# EAGLE design base (EAGLE 9.3.1)
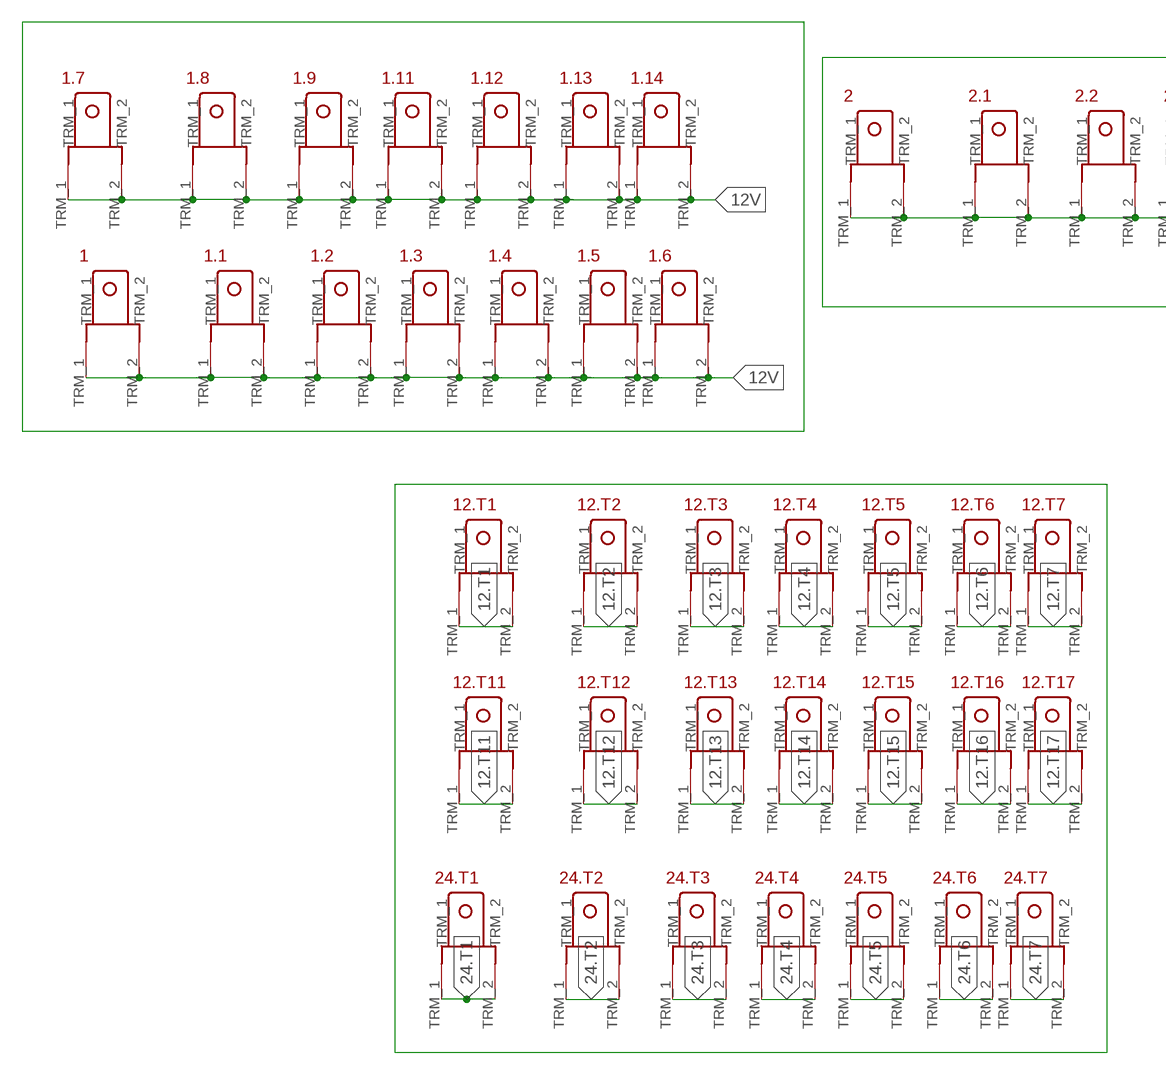
[diagram p0: schematic, sheet 1, part 1 of 2]
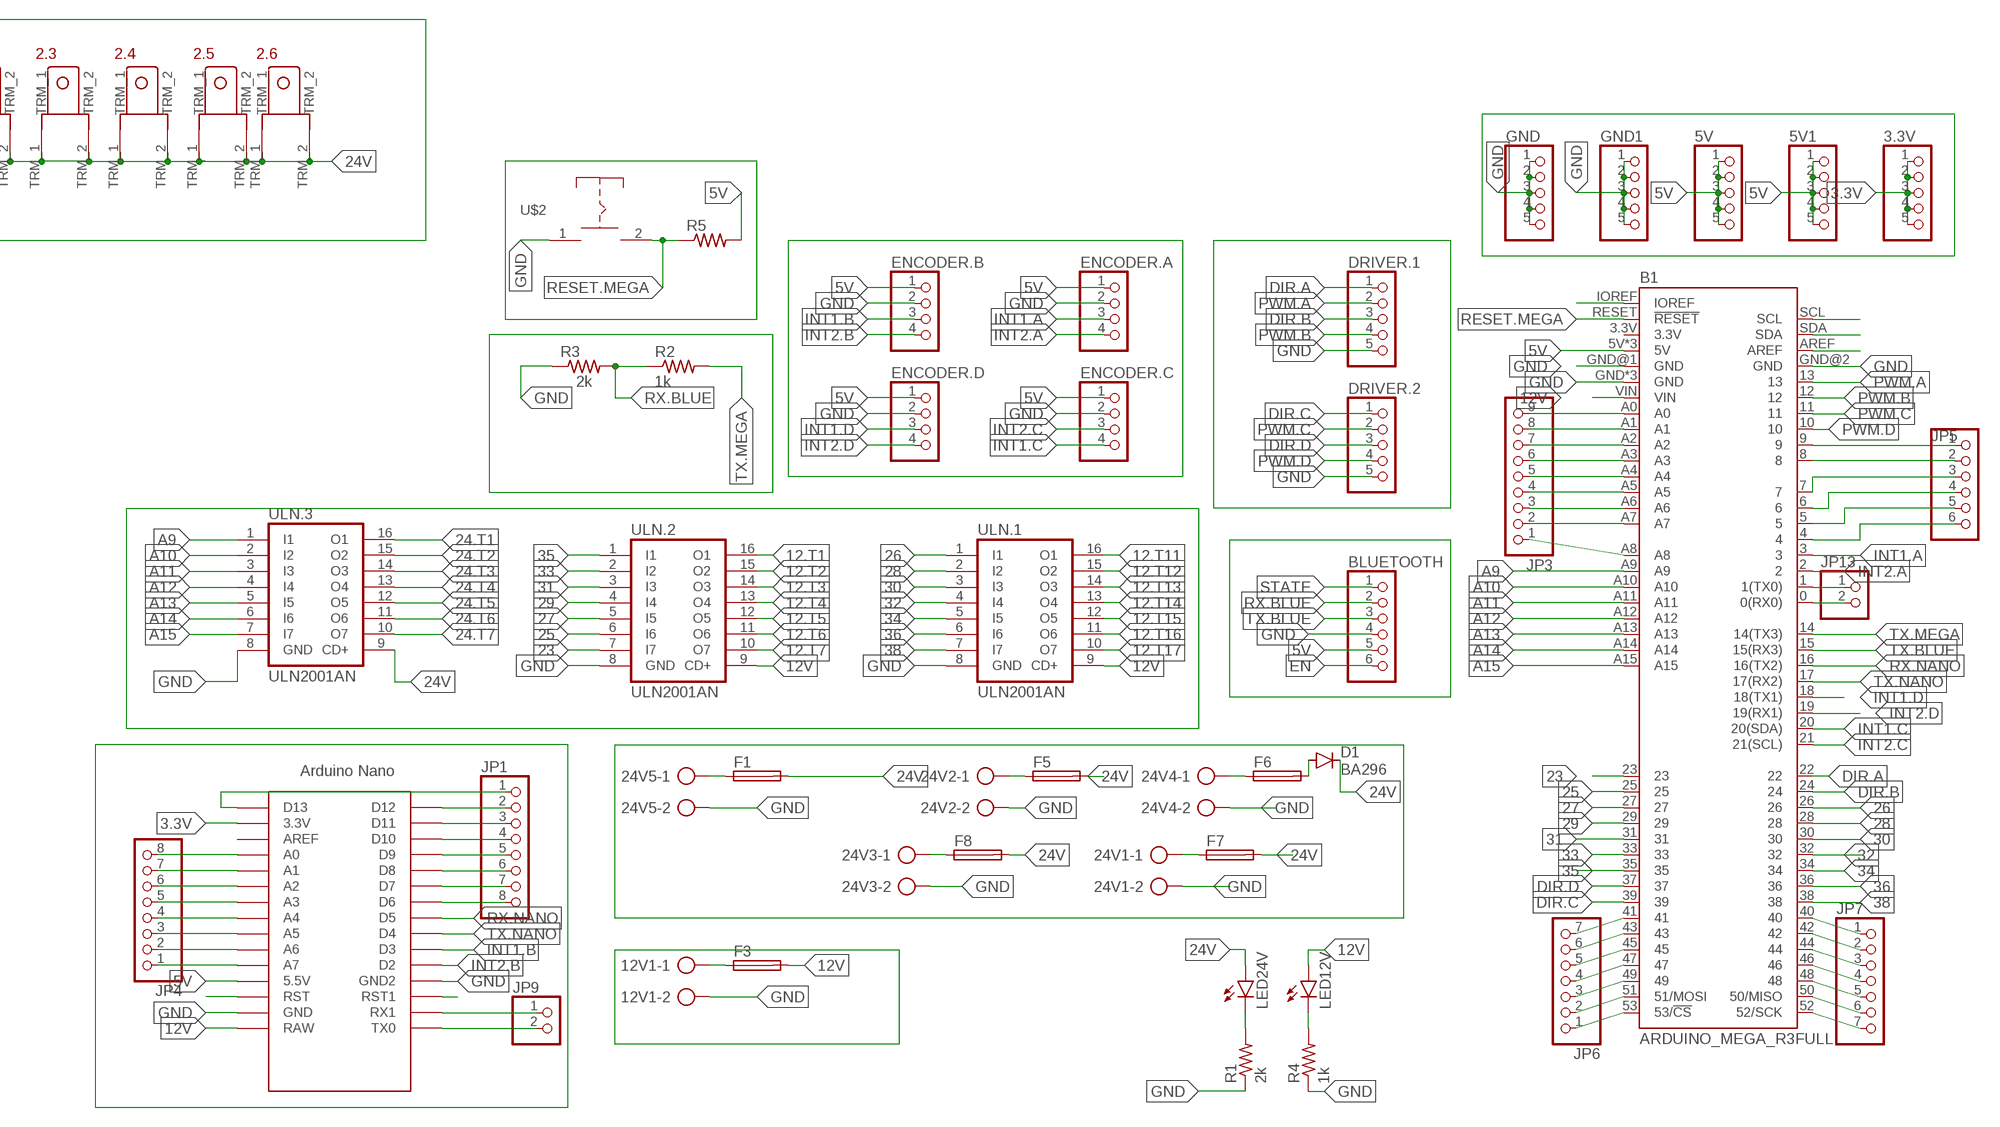
[diagram p1: schematic, sheet 1, part 2 of 2]

## Parts
1  TERMINAL_EDITED  [TERMINAL_EDITED]
1.1  TERMINAL_EDITED  [TERMINAL_EDITED]
1.2  TERMINAL_EDITED  [TERMINAL_EDITED]
1.3  TERMINAL_EDITED  [TERMINAL_EDITED]
1.4  TERMINAL_EDITED  [TERMINAL_EDITED]
1.5  TERMINAL_EDITED  [TERMINAL_EDITED]
1.6  TERMINAL_EDITED  [TERMINAL_EDITED]
1.7  TERMINAL_EDITED  [TERMINAL_EDITED]
1.8  TERMINAL_EDITED  [TERMINAL_EDITED]
1.9  TERMINAL_EDITED  [TERMINAL_EDITED]
1.11  TERMINAL_EDITED  [TERMINAL_EDITED]
1.12  TERMINAL_EDITED  [TERMINAL_EDITED]
1.13  TERMINAL_EDITED  [TERMINAL_EDITED]
1.14  TERMINAL_EDITED  [TERMINAL_EDITED]
2  TERMINAL_EDITED  [TERMINAL_EDITED]
2.1  TERMINAL_EDITED  [TERMINAL_EDITED]
2.2  TERMINAL_EDITED  [TERMINAL_EDITED]
2.3  TERMINAL_EDITED  [TERMINAL_EDITED]
2.4  TERMINAL_EDITED  [TERMINAL_EDITED]
2.5  TERMINAL_EDITED  [TERMINAL_EDITED]
2.6  TERMINAL_EDITED  [TERMINAL_EDITED]
3.3V  PINHD-1X5  [1X05]
5V  PINHD-1X5  [1X05]
5V1  PINHD-1X5  [1X05]
12.T1  TERMINAL_EDITED  [TERMINAL_EDITED]
12.T2  TERMINAL_EDITED  [TERMINAL_EDITED]
12.T3  TERMINAL_EDITED  [TERMINAL_EDITED]
12.T4  TERMINAL_EDITED  [TERMINAL_EDITED]
12.T5  TERMINAL_EDITED  [TERMINAL_EDITED]
12.T6  TERMINAL_EDITED  [TERMINAL_EDITED]
12.T7  TERMINAL_EDITED  [TERMINAL_EDITED]
12.T11  TERMINAL_EDITED  [TERMINAL_EDITED]
12.T12  TERMINAL_EDITED  [TERMINAL_EDITED]
12.T13  TERMINAL_EDITED  [TERMINAL_EDITED]
12.T14  TERMINAL_EDITED  [TERMINAL_EDITED]
12.T15  TERMINAL_EDITED  [TERMINAL_EDITED]
12.T16  TERMINAL_EDITED  [TERMINAL_EDITED]
12.T17  TERMINAL_EDITED  [TERMINAL_EDITED]
12V1  AK300/2  [AK300/2]
24.T1  TERMINAL_EDITED  [TERMINAL_EDITED]
24.T2  TERMINAL_EDITED  [TERMINAL_EDITED]
24.T3  TERMINAL_EDITED  [TERMINAL_EDITED]
24.T4  TERMINAL_EDITED  [TERMINAL_EDITED]
24.T5  TERMINAL_EDITED  [TERMINAL_EDITED]
24.T6  TERMINAL_EDITED  [TERMINAL_EDITED]
24.T7  TERMINAL_EDITED  [TERMINAL_EDITED]
24V1  AK300/2  [AK300/2]
24V2  AK300/2  [AK300/2]
24V3  AK300/2  [AK300/2]
24V4  AK300/2  [AK300/2]
24V5  AK300/2  [AK300/2]
B1  ARDUINO_MEGA_R3FULL  [ARDUINO_MEGA_NO_SILK]
BLUETOOTH  PINHD-1X6  [1X06]
D1  BA296  [P2-15]
DRIVER.1  PINHD-1X5  [1X05]
DRIVER.2  PINHD-1X5  [1X05]
ENCODER.A  PINHD-1X4  [1X04]
ENCODER.B  PINHD-1X4  [1X04]
ENCODER.C  PINHD-1X4  [1X04]
ENCODER.D  PINHD-1X4  [1X04]
F1  SH22,5A  [SH22,5A]
F3  SH22,5A  [SH22,5A]
F5  SH22,5A  [SH22,5A]
F6  SH22,5A  [SH22,5A]
F7  SH22,5A  [SH22,5A]
F8  SH22,5A  [SH22,5A]
GND  PINHD-1X5  [1X05]
GND1  PINHD-1X5  [1X05]
JP1  PINHD-1X8  [1X08]
JP3  PINHD-1X9  [1X09]
JP4  PINHD-1X8  [1X08]
JP5  PINHD-1X6  [1X06]
JP6  PINHD-1X7  [1X07]
JP7  PINHD-1X7  [1X07]
JP9  PINHD-1X2  [1X02]
JP13  PINHD-1X2  [1X02]
LED12V  LED5MM  [LED5MM]
LED24V  LED5MM  [LED5MM]
R1  2k  R-US_0207/10  [0207/10]
R2  1k  R-US_0204/7  [0204/7]
R3  2k  R-US_0207/10  [0207/10]
R4  1k  R-US_0207/10  [0207/10]
R5  R-US_0207/12  [0207/12]
U$1  NANO  [NANO]
U$2  PUSHBOTTON  [PUSHBOTTON]
ULN.1  ULN2001AN  [DIL16]
ULN.2  ULN2001AN  [DIL16]
ULN.3  ULN2001AN  [DIL16]

## Nets
3.3V: 3.3V.1 3.3V.2 3.3V.3 3.3V.4 3.3V.5 U$1.3.3V
5V: 5V1.1 5V1.2 5V1.3 5V1.4 5V1.5 5V.1 5V.2 5V.3 5V.4 5V.5 B1.5V B1.5V@1(5V) B1.5V@2(5V) BLUETOOTH.5 ENCODER.A.1 ENCODER.B.1 ENCODER.C.1 ENCODER.D.1 R5.2 U$1.5V(5.5V)
12.T1: 12.T1.TRM_1 12.T1.TRM_2 ULN.2.16(O1)
12.T2: 12.T2.TRM_1 12.T2.TRM_2 ULN.2.15(O2)
12.T3: 12.T3.TRM_1 12.T3.TRM_2 ULN.2.14(O3)
12.T4: 12.T4.TRM_1 12.T4.TRM_2 ULN.2.13(O4)
12.T5: 12.T5.TRM_1 12.T5.TRM_2 ULN.2.12(O5)
12.T6: 12.T6.TRM_1 12.T6.TRM_2 ULN.2.11(O6)
12.T7: 12.T7.TRM_1 12.T7.TRM_2 ULN.2.10(O7)
12.T11: 12.T11.TRM_1 12.T11.TRM_2 ULN.1.16(O1)
12.T12: 12.T12.TRM_1 12.T12.TRM_2 ULN.1.15(O2)
12.T13: 12.T13.TRM_1 12.T13.TRM_2 ULN.1.14(O3)
12.T14: 12.T14.TRM_1 12.T14.TRM_2 ULN.1.13(O4)
12.T15: 12.T15.TRM_1 12.T15.TRM_2 ULN.1.12(O5)
12.T16: 12.T16.TRM_1 12.T16.TRM_2 ULN.1.11(O6)
12.T17: 12.T17.TRM_1 12.T17.TRM_2 ULN.1.10(O7)
12V: 1.1.TRM_1 1.1.TRM_2 1.2.TRM_1 1.2.TRM_2 1.3.TRM_1 1.3.TRM_2 1.4.TRM_1 1.4.TRM_2 1.5.TRM_1 1.5.TRM_2 1.6.TRM_1 1.6.TRM_2 1.7.TRM_1 1.7.TRM_2 1.8.TRM_1 1.8.TRM_2 1.9.TRM_1 1.9.TRM_2 1.11.TRM_1 1.11.TRM_2 1.12.TRM_1 1.12.TRM_2 1.13.TRM_1 1.13.TRM_2 1.14.TRM_1 1.14.TRM_2 1.TRM_1 1.TRM_2 B1.VIN F3.2 LED12V.A U$1.RAW ULN.1.9(CD+) ULN.2.9(CD+)
23: B1.23 ULN.2.7(I7)
24.T1: 24.T1.TRM_1 24.T1.TRM_2 ULN.3.16(O1)
24.T2: 24.T2.TRM_1 24.T2.TRM_2 ULN.3.15(O2)
24.T3: 24.T3.TRM_1 24.T3.TRM_2 ULN.3.14(O3)
24.T4: 24.T4.TRM_1 24.T4.TRM_2 ULN.3.13(O4)
24.T5: 24.T5.TRM_1 24.T5.TRM_2 ULN.3.12(O5)
24.T6: 24.T6.TRM_1 24.T6.TRM_2 ULN.3.11(O6)
24.T7: 24.T7.TRM_1 24.T7.TRM_2 ULN.3.10(O7)
24V: 2.1.TRM_1 2.1.TRM_2 2.2.TRM_1 2.2.TRM_2 2.3.TRM_1 2.3.TRM_2 2.4.TRM_1 2.4.TRM_2 2.5.TRM_1 2.5.TRM_2 2.6.TRM_1 2.6.TRM_2 2.TRM_1 2.TRM_2 D1.C F1.2 F5.2 F7.2 F8.2 LED24V.A ULN.3.9(CD+)
25: B1.25 ULN.2.6(I6)
26: B1.26 ULN.1.1(I1)
27: B1.27 ULN.2.5(I5)
28: B1.28 ULN.1.2(I2)
29: B1.29 ULN.2.4(I4)
30: B1.30 ULN.1.3(I3)
31: B1.31 ULN.2.3(I3)
32: B1.32 ULN.1.4(I4)
33: B1.33 ULN.2.2(I2)
34: B1.34 ULN.1.5(I5)
35: B1.35 ULN.2.1(I1)
36: B1.36 ULN.1.6(I6)
38: B1.38 ULN.1.7(I7)
40: B1.40 JP7.1
A9: B1.A9 ULN.3.1(I1)
A10: B1.A10 ULN.3.2(I2)
A11: B1.A11 ULN.3.3(I3)
A12: B1.A12 ULN.3.4(I4)
A13: B1.A13 ULN.3.5(I5)
A14: B1.A14 ULN.3.6(I6)
A15: B1.A15 ULN.3.7(I7)
DIR.A: B1.22 DRIVER.1.1
DIR.B: B1.24 DRIVER.1.3
DIR.C: B1.39 DRIVER.2.1
DIR.D: B1.37 DRIVER.2.3
EN: BLUETOOTH.6
GND: 12V1.2 24V1.2 24V2.2 24V3.2 24V4.2 24V5.2 B1.GND B1.GND@1(GND) B1.GND@2(GND) B1.GND@3(GND) B1.GND@4(GND) BLUETOOTH.4 DRIVER.1.5 DRIVER.2.5 ENCODER.A.2 ENCODER.B.2 ENCODER.C.2 ENCODER.D.2 GND1.1 GND1.2 GND1.3 GND1.4 GND1.5 GND.1 GND.2 GND.3 GND.4 GND.5 R1.1 R3.1 R4.1 U$1.GND U$1.GND1(GND2) U$2.1 ULN.1.8(GND) ULN.2.8(GND) ULN.3.8(GND)
INT1.A: B1.3 ENCODER.A.3
INT1.B: ENCODER.B.3 U$1.D3
INT1.C: B1.20(20(SDA)) ENCODER.C.4
INT1.D: B1.18(18(TX1)) ENCODER.D.3
INT2.A: B1.2 ENCODER.A.4
INT2.B: ENCODER.B.4 U$1.D2
INT2.C: B1.21(21(SCL)) ENCODER.C.3
INT2.D: B1.19(19(RX1)) ENCODER.D.4
N$1: B1.SCL
N$2: B1.SDA
N$3: B1.AREF
N$9: B1.9 JP5.1
N$10: B1.8 JP5.2
N$11: B1.7 JP5.3
N$12: B1.6 JP5.4
N$13: B1.5 JP5.5
N$14: B1.4 JP5.6
N$15: 24V1.1 F7.1
N$16: 24V4.1 F6.1
N$17: B1.1(1(TX0)) JP13.1
N$18: B1.0(0(RX0)) JP13.2
N$21: 24V2.1 F5.1
N$22: 24V3.1 F8.1
N$23: LED24V.K(C) R1.2
N$24: LED12V.K(C) R4.2
N$25: D1.A F6.2
N$37: B1.42 JP7.2
N$38: B1.44 JP7.3
N$39: B1.46 JP7.4
N$40: B1.48 JP7.5
N$41: B1.50(50/MISO) JP7.6
N$42: B1.52(52/SCK) JP7.7
N$43: B1.IOREF
N$50: B1.A0 JP3.9
N$51: B1.A1 JP3.8
N$52: B1.A2 JP3.7
N$53: B1.A3 JP3.6
N$54: B1.A4 JP3.5
N$55: B1.A5 JP3.4
N$56: B1.A6 JP3.3
N$57: B1.A7 JP3.2
N$58: B1.A8 JP3.1
N$75: B1.41 JP6.7
N$76: B1.45 JP6.5
N$77: B1.43 JP6.6
N$78: B1.47 JP6.4
N$79: B1.49 JP6.3
N$80: B1.51(51/MOSI) JP6.2
N$81: B1.53(53/!CS) JP6.1
N$107: JP1.1 U$1.D13
N$110: JP4.8 U$1.A0
N$111: JP4.7 U$1.A1
N$112: JP4.6 U$1.A2
N$113: JP4.5 U$1.A3
N$114: JP4.4 U$1.A4
N$115: JP4.3 U$1.A5
N$116: JP4.2 U$1.A6
N$117: JP4.1 U$1.A7
N$119: U$1.RST
N$122: JP1.2 U$1.D12
N$123: JP1.3 U$1.D11
N$124: JP1.4 U$1.D10
N$125: JP1.5 U$1.D9
N$126: JP1.6 U$1.D8
N$127: JP1.7 U$1.D7
N$128: JP1.8 U$1.D6
N$134: U$1.RST1
N$135: JP9.1 U$1.RX1
N$136: JP9.2 U$1.TX0
N$138: 24V5.1 F1.1
N$152: 12V1.1 F3.1
PWM.A: B1.13 DRIVER.1.2
PWM.B: B1.12 DRIVER.1.4
PWM.C: B1.11 DRIVER.2.2
PWM.D: B1.10 DRIVER.2.4
RESET.MEGA: B1.RESET(!RESET) R5.1 U$2.2
RX.BLUE: BLUETOOTH.2 R2.1 R3.2
RX.NANO: B1.16(16(TX2)) U$1.D5
STATE: BLUETOOTH.1
TX.BLUE: B1.15(15(RX3)) BLUETOOTH.3
TX.MEGA: B1.14(14(TX3)) R2.2
TX.NANO: B1.17(17(RX2)) U$1.D4
Unconnected: B1.3.3V U$1.AREF

## Library data of the parts
1 1.1-1.9 1.11-1.14 2 2.1-2.6 12.T1-12.T7 12.T11-12.T17 24.T1-24.T7 = 1-ROV Components:TERMINAL_EDITED
3.3V 5V 5V1 DRIVER.1 DRIVER.2 GND GND1 = pinhead:PINHD-1X5: PIN HEADER
12V1 24V1-24V5 = con-ptr500:AK300/2: CONNECTOR; OC_FARNELL: unknown; OC_NEWARK: unknown
B1 = SparkFun-Boards:ARDUINO_MEGA_R3: Arduino Mega R3 ATmega2560 R3 compatible footprint. SparkFun Products: Arduino Mega 2560 R3 <https://www.sparkfun.com/products/11061>
BLUETOOTH JP5 = pinhead:PINHD-1X6: PIN HEADER
D1 = diode:BA296: DIODE
ENCODER.A ENCODER.B ENCODER.C ENCODER.D = pinhead:PINHD-1X4: PIN HEADER
F1 F3 F5-F8 = fuse:SH22,5A: FUSE HOLDER grid 22,5mm, isolated cap OGN0031 8201, Schurter (Buerklin); MPN: 0031.7701.11; OC_FARNELL: unknown; OC_NEWARK: 04F1224
JP1 JP4 = pinhead:PINHD-1X8: PIN HEADER
JP3 = pinhead:PINHD-1X9: PIN HEADER
JP6 JP7 = pinhead:PINHD-1X7: PIN HEADER
JP9 JP13 = pinhead:PINHD-1X2: PIN HEADER
LED12V LED24V = led:LED: LED OSRAM: - CHIPLED LG R971, LG N971, LY N971, LG Q971, LY Q971, LO R971, LY R971 LH N974, LH R974 LS Q976, LO Q976, LY Q976 LO Q996 - Hyper CHIPLED LW Q18S LB Q993, LB Q99A, LB R99A - SideLED LS A670, LO A670, LY A670, LG A670, LP A670 LB A673, LV A673, LT A673, LW A673 LH A674 LY A675 LS A676, LA A676, LO A676, LY A676, LW A676 LS A679, LY A679, LG A679 - Hyper Micro SIDELED® LS Y876, LA Y876, LO Y876, LY Y876 LT Y87S - SmartLED LW L88C, LW L88S LB L89C, LB L89S, LG L890 LS L89K, LO L89K, LY L89K LS L896, LA L896, LO L896, LY L896 - TOPLED LS T670, LO T670, LY T670, LG T670, LP T670 LSG T670, LSP T670, LSY T670, LOP T670, LYG T670 LG T671, LOG T671, LSG T671 LB T673, LV T673, LT T673, LW T673 LH T674 LS T676, LA T676, LO T676, LY T676, LB T676, LH T676, LSB T676, LW T676 LB T67C, LV T67C, LT T67C, LS T67K, LO T67K, LY T67K, LW E67C LS E67B, LA E67B, LO E67B, LY E67B, LB E67C, LV E67C, LT E67C LW T67C LS T679, LY T679, LG T679 LS T770, LO T770, LY T770, LG T770, LP T770 LB T773, LV T773, LT T773, LW T773 LH T774 LS E675, LA E675, LY E675, LS T675 LS T776, LA T776, LO T776, LY T776, LB T776 LHGB T686 LT T68C, LB T68C - Hyper Mini TOPLED® LB M676 - Mini TOPLED Santana® LG M470 LS M47K, LO M47K, LY M47K Source: http://www.osram.convergy.de LUXEON: - LUMILED® LXK2-PW12-R00, LXK2-PW12-S00, LXK2-PW14-U00, LXK2-PW14-V00 LXK2-PM12-R00, LXK2-PM12-S00, LXK2-PM14-U00 LXK2-PE12-Q00, LXK2-PE12-R00, LXK2-PE12-S00, LXK2-PE14-T00, LXK2-PE14-U00 LXK2-PB12-K00, LXK2-PB12-L00, LXK2-PB12-M00, LXK2-PB14-N00, LXK2-PB14-P00, LXK2-PB14-Q00 LXK2-PR12-L00, LXK2-PR12-M00, LXK2-PR14-Q00, LXK2-PR14-R00 LXK2-PD12-Q00, LXK2-PD12-R00, LXK2-PD12-S00 LXK2-PH12-R00, LXK2-PH12-S00 LXK2-PL12-P00, LXK2-PL12-Q00, LXK2-PL12-R00 Source: www.luxeon.com KINGBRIGHT: KA-3528ASYC Source: www.kingbright.com
R1-R5 = rcl:R-US_: RESISTOR, American symbol; SPICEPREFIX: R
U$1 = Arduino-clone:NANO: Arduino Nano
U$2 = push botton:PUSHBOTTON
ULN.1-ULN.3 = uln-udn:ULN2001A: DRIVER ARRAY

## Board
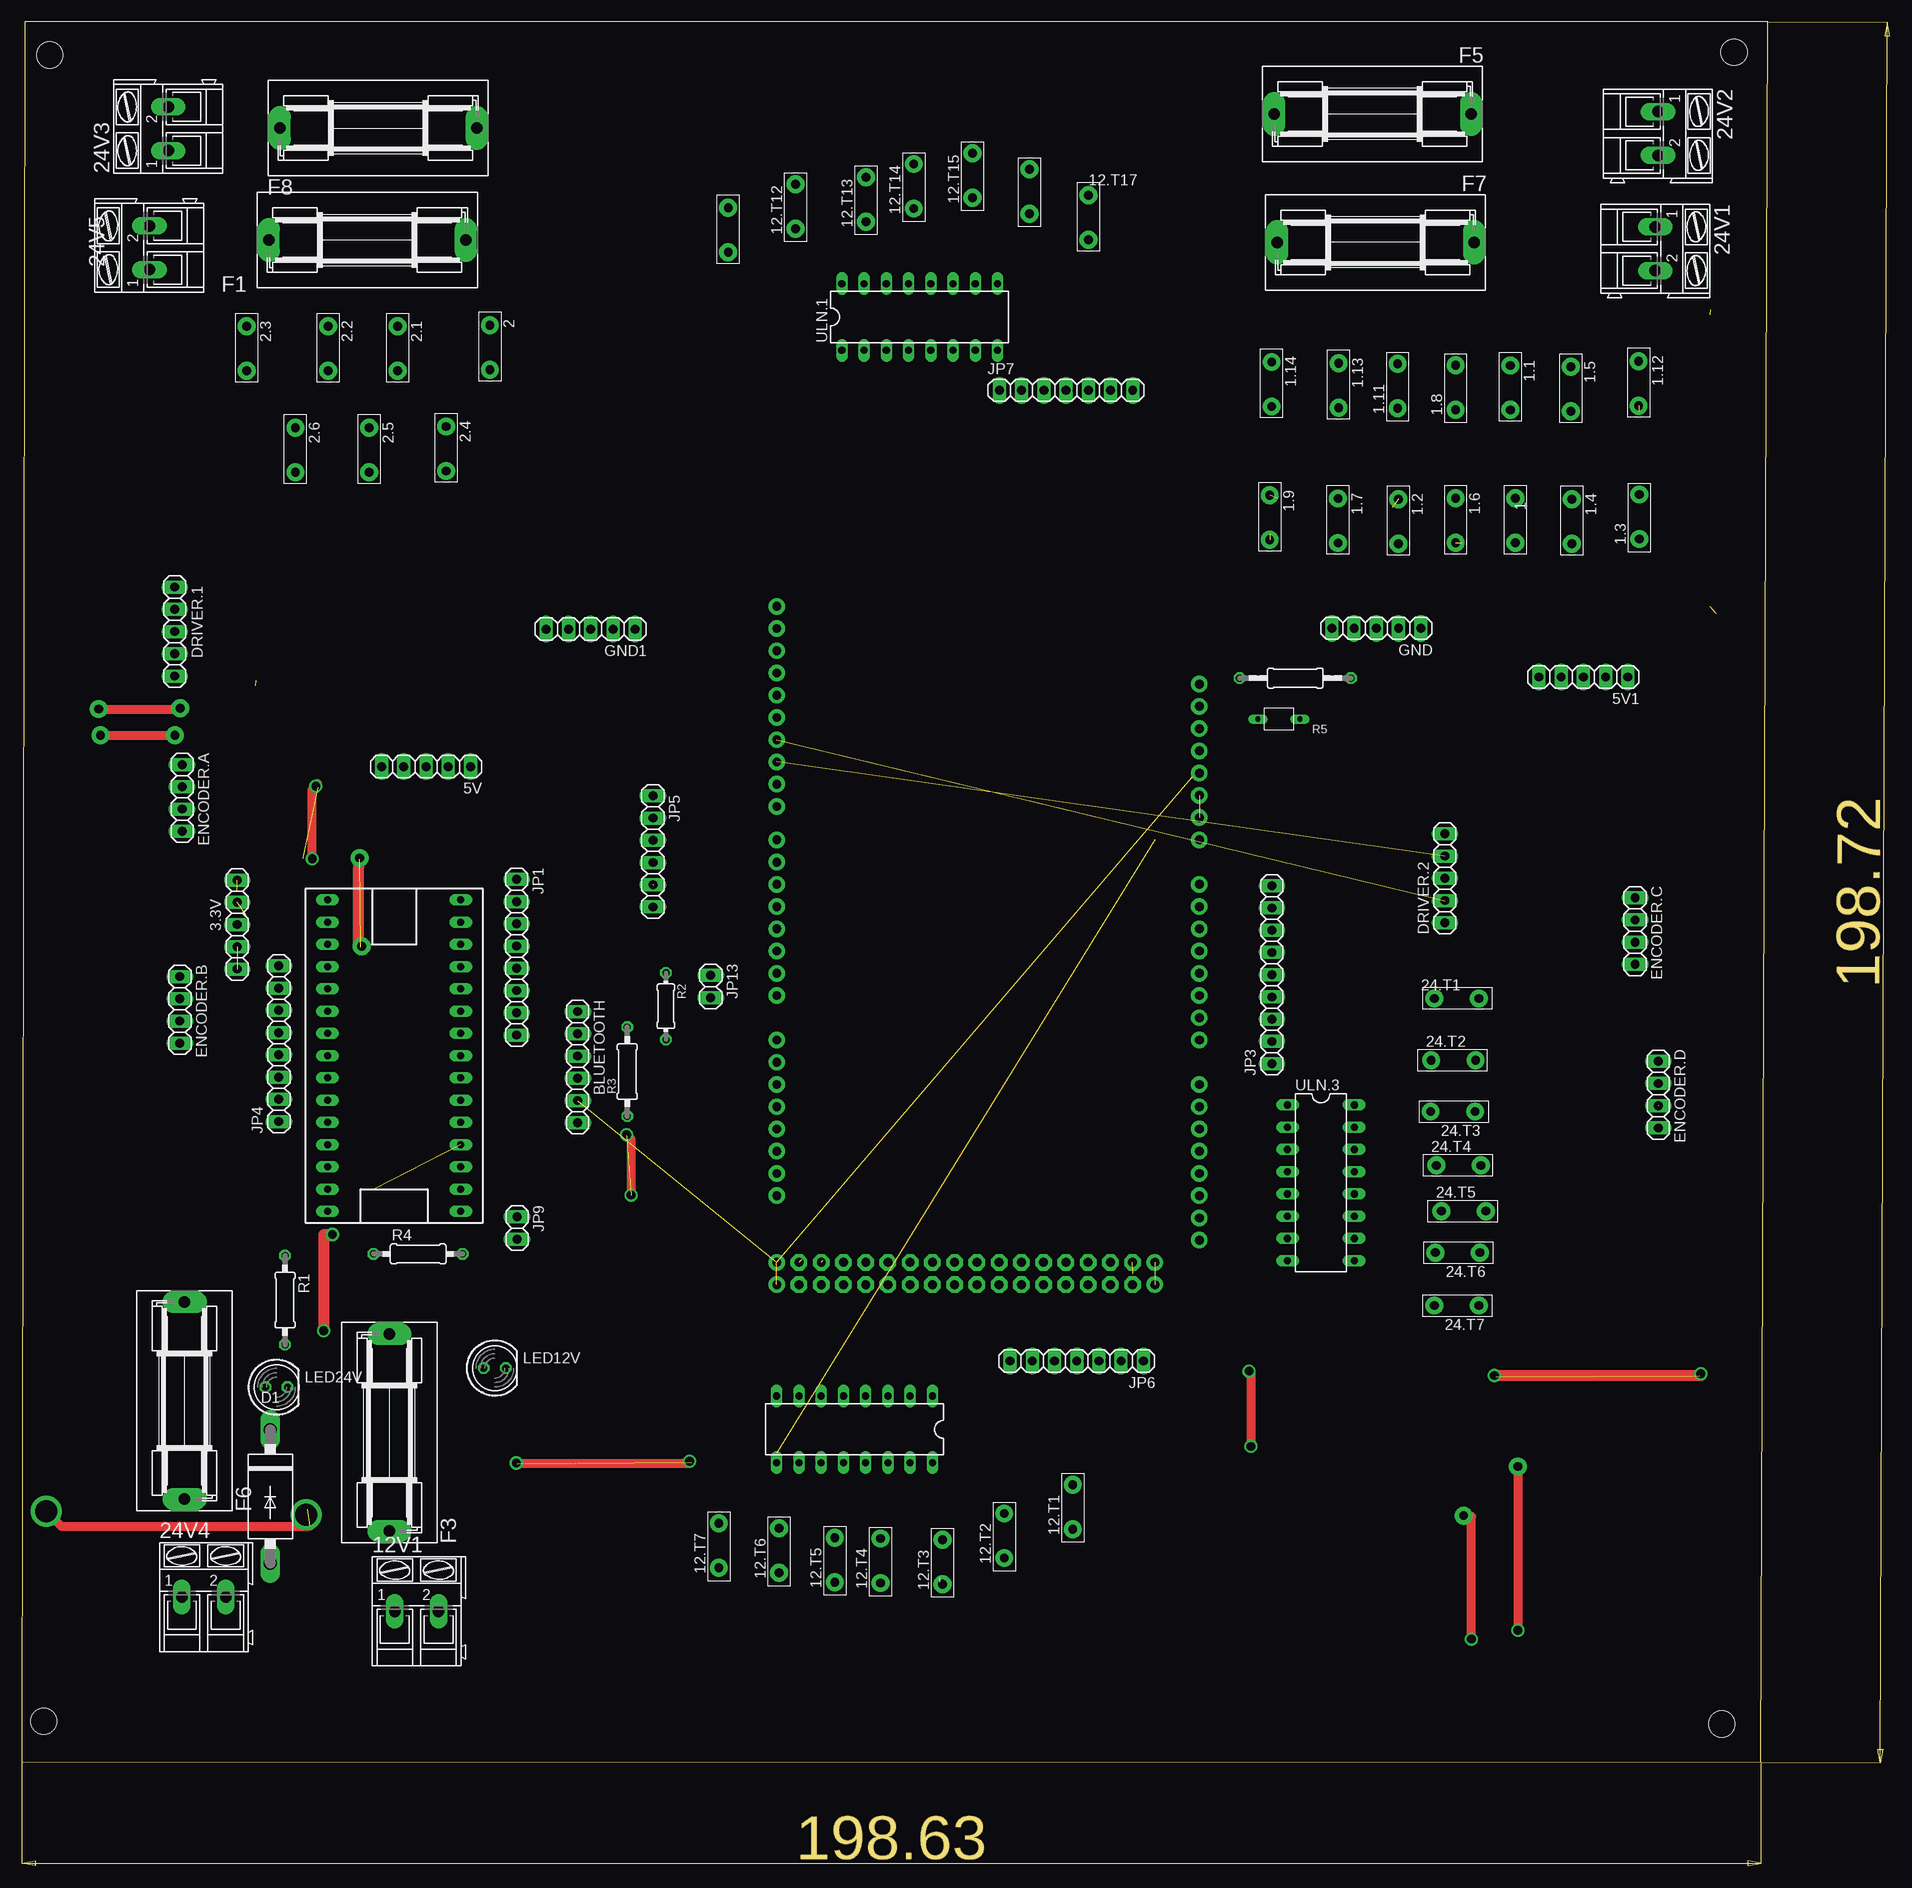
[diagram p2: board, top side]
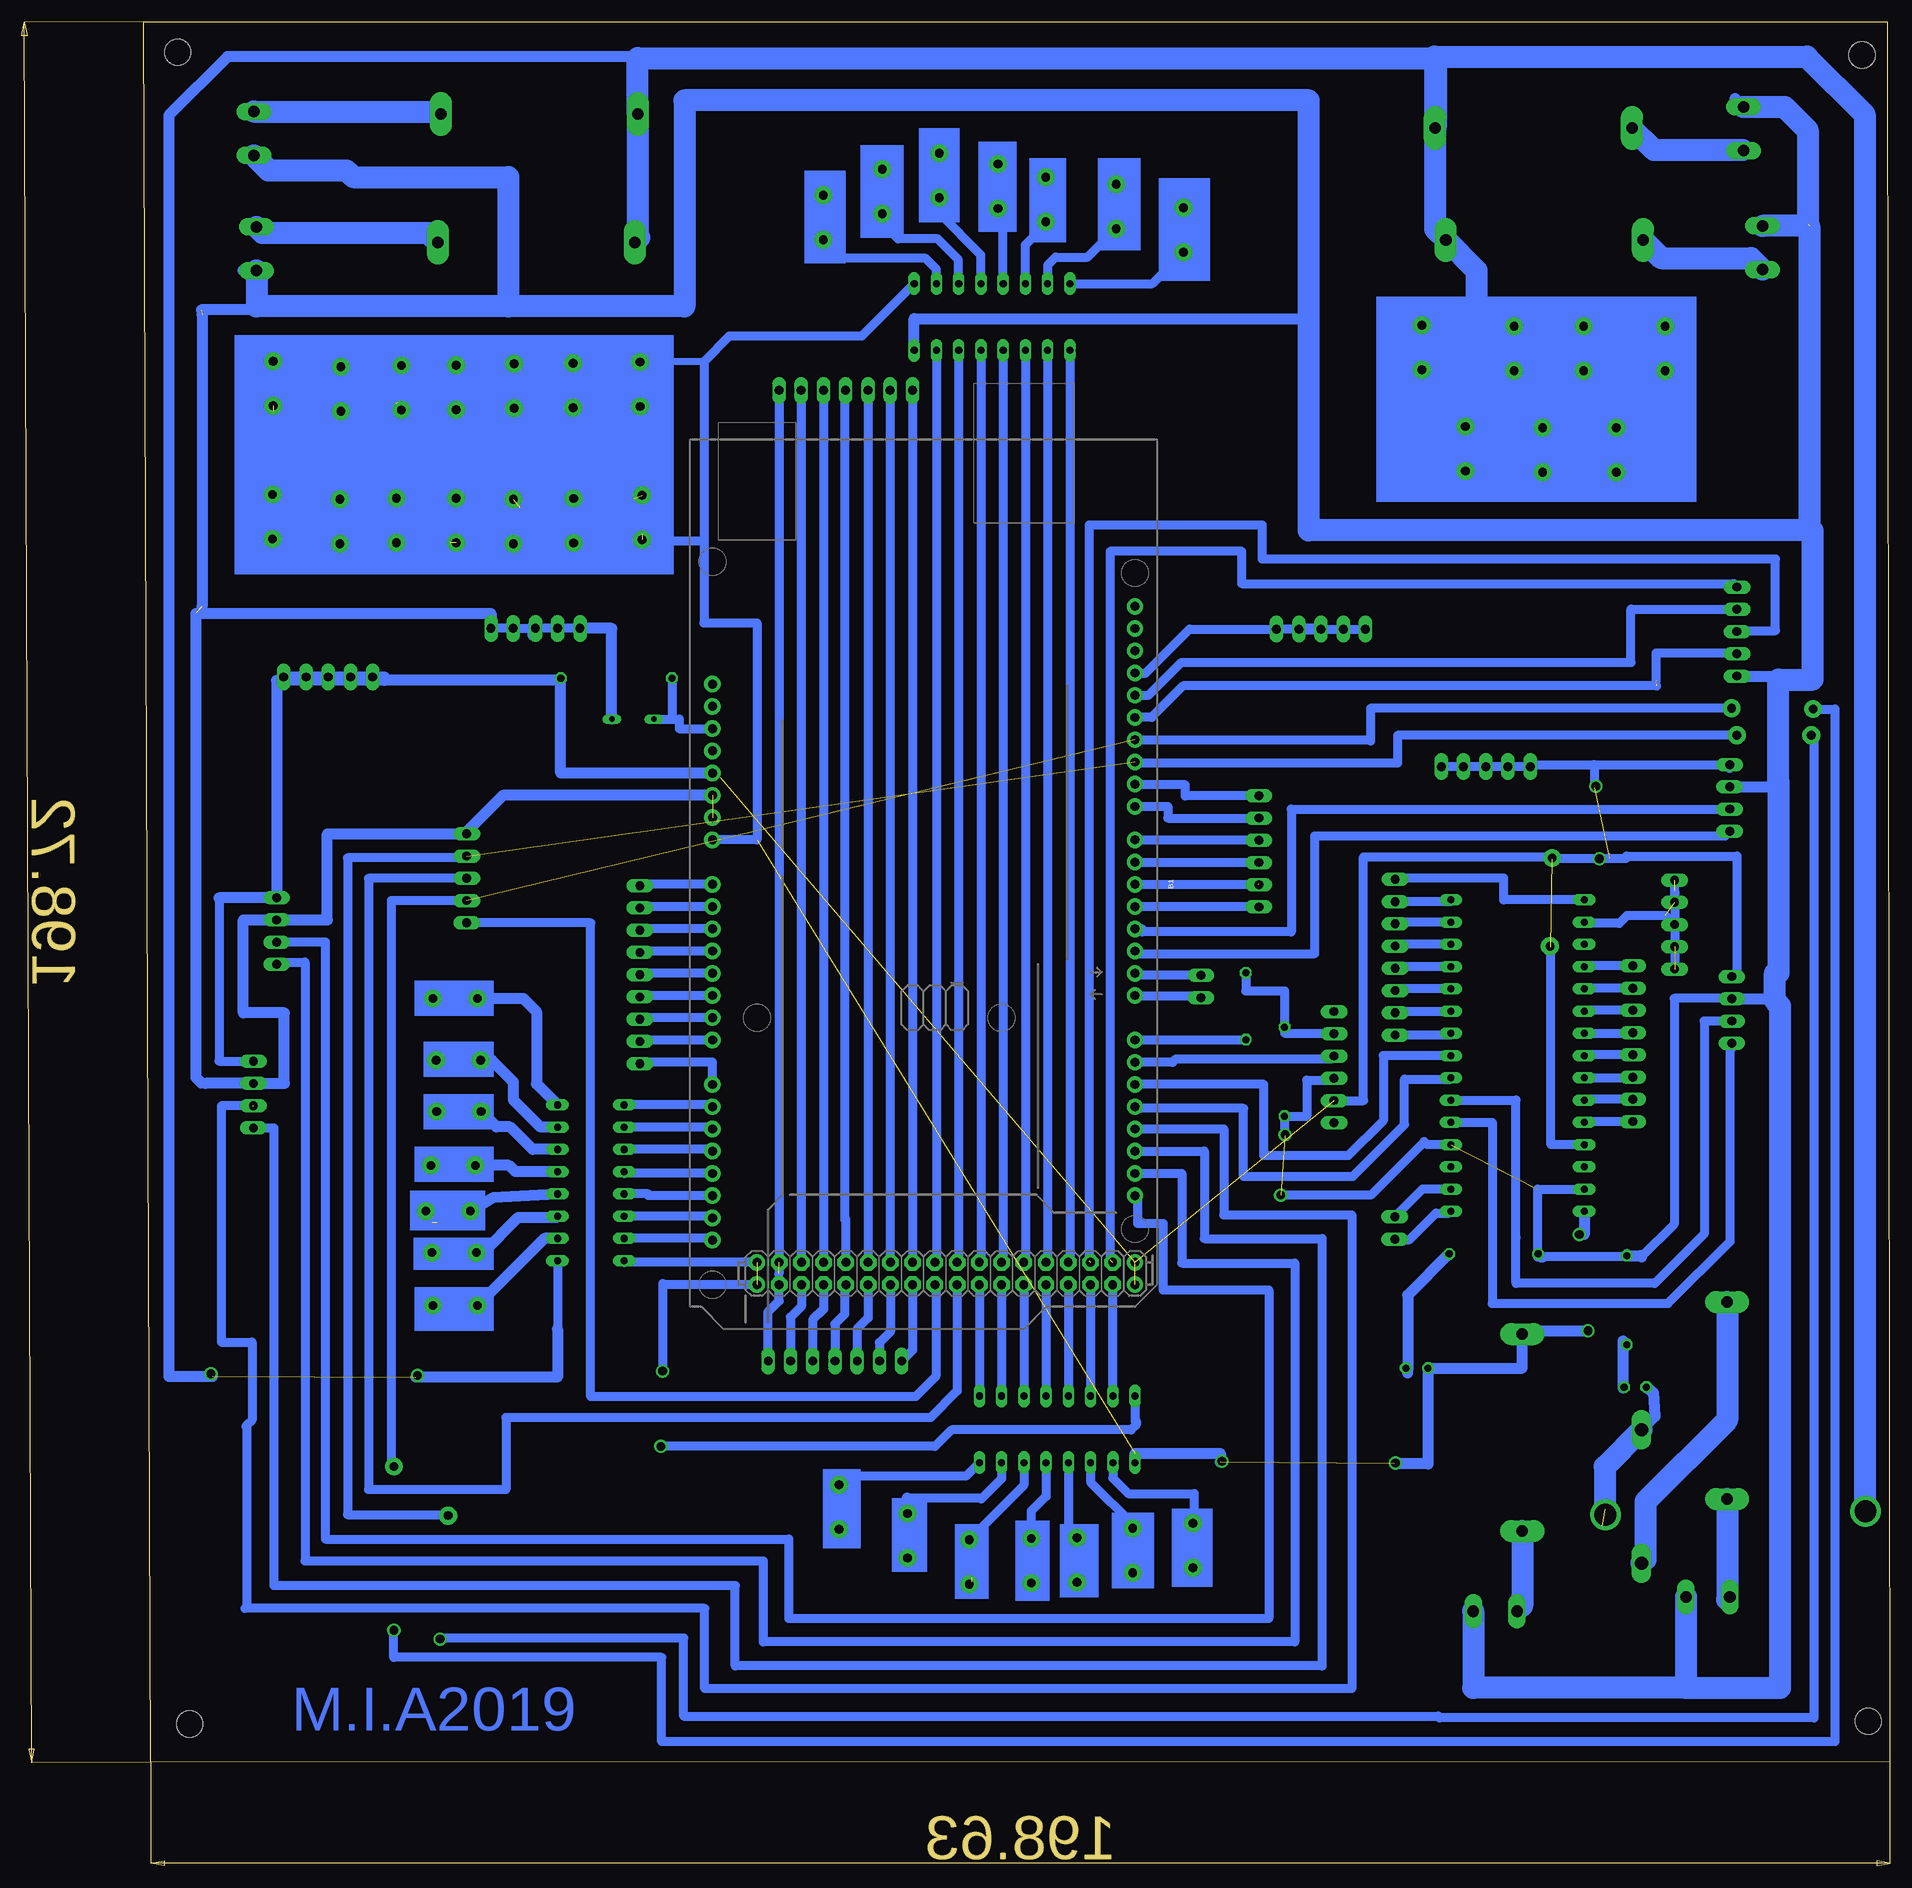
[diagram p3: board, bottom side, seen from below]

Size 199.44 x 198.72 mm. Coordinates in mm from the lower left corner, seen from the top.
Outline: 0,0.02 198.63,0 199.44,198.72 0.31,198.71 0,0.02
Copper layers (1*16): Top 0.035mm / dielectric 1.5mm / Bottom 0.035mm
Design rules "default *": minimum track width 6mil, minimum drill 0.35mm, track to track 40mil, track to pad 40mil, pad to pad 6mil, via to via 6mil, smd to smd 6mil, copper to edge 40mil, drill to drill 6mil, minimum pad ring 10mil, minimum via ring 8mil, stop-mask expansion 4mil, vias tented up to drill 0mil, thermal gap 10mil
Holes 3 mm at 194.18,4.34 2.48,4.64 3.18,194.94 195.58,195.24

### Footprints (pad centres in the part's own frame; a part is rotated, then mirrored left to right if it is on the bottom)
TERMINAL_EDITED = drill 1 pad 2.032: TRM_1 -2.54,0; TRM_2 2.54,0
1X05 = drill 1.016 long: 1 -5.08,0; 2 -2.54,0; 3 0,0; 4 2.54,0; 5 5.08,0
AK300/2 = drill 1.321 long: 1 -2.515,0; 2 2.489,0
ARDUINO_MEGA_NO_SILK = drill 1.016 pad 1.88: 0 13.97,24.13; 1 11.43,24.13; 2 8.89,24.13; 3 6.35,24.13; 3.3V -13.97,-24.13; 4 3.81,24.13; 5 1.27,24.13; 5V -11.43,-24.13; 5V@1 44.45,24.13; 5V@2 46.99,24.13; 6 -1.27,24.13; 7 -3.81,24.13; 8 -7.62,24.13; 9 -10.16,24.13; 10 -12.7,24.13; 11 -15.24,24.13; 12 -17.78,24.13; 13 -20.32,24.13; 14 19.05,24.13; 15 21.59,24.13; 16 24.13,24.13; 17 26.67,24.13; 18 29.21,24.13; 19 31.75,24.13; 20 34.29,24.13; 21 36.83,24.13; A0 1.27,-24.13; A1 3.81,-24.13; A2 6.35,-24.13; A3 8.89,-24.13; A4 11.43,-24.13; A5 13.97,-24.13; A6 16.51,-24.13; A7 19.05,-24.13; A8 24.13,-24.13; A9 26.67,-24.13; A10 29.21,-24.13; A11 31.75,-24.13; A12 34.29,-24.13; A13 36.83,-24.13; A14 39.37,-24.13; A15 41.91,-24.13; AREF -25.4,24.13; GND -8.89,-24.13; GND@1 -6.35,-24.13; GND@2 44.45,-19.05; GND@3 46.99,-19.05; GND@4 -22.86,24.13; IOREF -19.05,-24.13; NC -21.59,-24.13; RESET -16.51,-24.13; SCL -30.48,24.13; SDA -27.94,24.13; VIN -3.81,-24.13 | drill 1.016 pad 1.88 octagon: 22 44.45,21.59; 23 46.99,21.59; 24 44.45,19.05; 25 46.99,19.05; 26 44.45,16.51; 27 46.99,16.51; 28 44.45,13.97; 29 46.99,13.97; 30 44.45,11.43; 31 46.99,11.43; 32 44.45,8.89; 33 46.99,8.89; 34 44.45,6.35; 35 46.99,6.35; 36 44.45,3.81; 37 46.99,3.81; 38 44.45,1.27; 39 46.99,1.27; 40 44.45,-1.27; 41 46.99,-1.27; 42 44.45,-3.81; 43 46.99,-3.81; 44 44.45,-6.35; 45 46.99,-6.35; 46 44.45,-8.89; 47 46.99,-8.89; 48 44.45,-11.43; 49 46.99,-11.43; 50 44.45,-13.97; 51 46.99,-13.97; 52 44.45,-16.51; 53 46.99,-16.51
1X06 = drill 1.016 long: 1 -6.35,0; 2 -3.81,0; 3 -1.27,0; 4 1.27,0; 5 3.81,0; 6 6.35,0
P2-15 = drill 1.499 long: A 7.62,0; C -7.62,0
1X04 = drill 1.016 long: 1 -3.81,0; 2 -1.27,0; 3 1.27,0; 4 3.81,0
SH22,5A = drill 1.321 pad 2.54 long: 1 -11.252,0; 2 11.252,0
1X08 = drill 1.016 long: 1 -8.89,0; 2 -6.35,0; 3 -3.81,0; 4 -1.27,0; 5 1.27,0; 6 3.81,0; 7 6.35,0; 8 8.89,0
1X09 = drill 1.016 long: 1 -10.16,0; 2 -7.62,0; 3 -5.08,0; 4 -2.54,0; 5 0,0; 6 2.54,0; 7 5.08,0; 8 7.62,0; 9 10.16,0
1X07 = drill 1.016 long: 1 -7.62,0; 2 -5.08,0; 3 -2.54,0; 4 0,0; 5 2.54,0; 6 5.08,0; 7 7.62,0
1X02 = drill 1.016 long: 1 -1.27,0; 2 1.27,0
LED5MM = drill 0.813 octagon: A -1.27,0; K 1.27,0
0207/10 = drill 0.813 octagon: 1 -5.08,0; 2 5.08,0
0204/7 = drill 0.813 octagon: 1 -3.81,0; 2 3.81,0
0207/12 = drill 0.813 octagon: 1 -6.35,0; 2 6.35,0
NANO = drill 0.8 long: 3.3V -10.16,24.13; 5V -10.16,-1.27; A0 -10.16,19.05; A1 -10.16,16.51; A2 -10.16,13.97; A3 -10.16,11.43; A4 -10.16,8.89; A5 -10.16,6.35; A6 -10.16,3.81; A7 -10.16,1.27; AREF -10.16,21.59; D2 5.08,1.27; D3 5.08,3.81; D4 5.08,6.35; D5 5.08,8.89; D6 5.08,11.43; D7 5.08,13.97; D8 5.08,16.51; D9 5.08,19.05; D10 5.08,21.59; D11 5.08,24.13; D12 5.08,26.67; D13 -10.16,26.67; GND -10.16,-6.35; GND1 5.08,-1.27; RAW -10.16,-8.89; RST -10.16,-3.81; RST1 5.08,-3.81; RX1 5.08,-6.35; TX0 5.08,-8.89
PUSHBOTTON = drill 0.6 long: 1 -12.43,5.08; 2 -7.62,5.08
DIL16 = drill 0.813 long: 1 -8.89,-3.81; 2 -6.35,-3.81; 3 -3.81,-3.81; 4 -1.27,-3.81; 5 1.27,-3.81; 6 3.81,-3.81; 7 6.35,-3.81; 8 8.89,-3.81; 9 8.89,3.81; 10 6.35,3.81; 11 3.81,3.81; 12 1.27,3.81; 13 -1.27,3.81; 14 -3.81,3.81; 15 -6.35,3.81; 16 -8.89,3.81

### Placement (x,y rotation side)
1  170.59,141.77 270 top
1.1  170.01,156.95 270 top
1.2  157.23,141.67 270 top
1.3  184.73,142.21 90 top
1.4  177.05,141.67 270 top
1.5  176.93,156.8 270 top
1.6  163.76,141.77 270 top
1.7  150.33,141.75 270 top
1.8  163.76,156.98 90 top
1.9  142.53,142.11 270 top
1.11  157.14,157.14 90 top
1.12  184.67,157.43 270 top
1.13  150.4,157.21 270 top
1.14  142.75,157.33 270 top
2  53.46,161.54 270 top
2.1  42.91,161.42 270 top
2.2  34.98,161.42 270 top
2.3  25.67,161.42 270 top
2.4  48.47,149.97 270 top
2.5  39.66,149.84 270 top
2.6  31.23,149.84 270 top
3.3V  24.59,95.64 90 top
5V  46.16,113.68 180 top
5V1  178.36,123.9 180 top
12.T1  120.04,29.12 90 top
12.T2  112.21,25.84 90 top
12.T3  105.14,22.85 90 top
12.T4  98.07,22.98 90 top
12.T5  92.86,23.08 90 top
12.T6  86.48,24.15 90 top
12.T7  79.61,24.72 90 top
12.T11  80.68,174.94 270 top
12.T12  88.38,177.64 90 top
12.T13  96.41,178.44 90 top
12.T14  101.88,179.94 90 top
12.T15  108.58,181.18 90 top
12.T16  115.08,179.34 90 top
12.T17  121.83,176.37 270 top
12V1  45.1,17.22 0 top
24.T1  163.87,87.2 180 top
24.T2  163.52,80.15 0 top
24.T3  163.44,74.28 180 top
24.T4  164.12,68.14 0 top
24.T5  164.67,62.91 0 top
24.T6  164,58.17 180 top
24.T7  163.88,52.13 180 top
24V1  186.57,172.79 270 top
24V2  186.88,185.96 270 top
24V3  16.72,186.53 90 top
24V4  20.79,18.85 0 top
24V5  14.56,172.94 90 top
B1  110.36,101.5 270 bottom
BLUETOOTH  63.49,79.35 270 top
D1  28.36,30.32 270 top
DRIVER.1  17.46,129.1 270 top
DRIVER.2  162.54,100.92 90 top
ENCODER.A  18.3,110.1 270 top
ENCODER.B  18.05,85.89 270 top
ENCODER.C  184.27,94.89 270 top
ENCODER.D  186.92,76.22 270 top
F1  39.46,173.81 0 top
F3  41.98,37.63 90 top
F5  154.27,188.2 180 top
F6  18.59,41.27 90 top
F7  154.62,173.54 180 top
F8  40.7,186.6 0 top
GND  154.71,129.46 180 top
GND1  64.97,129.38 180 top
JP1  56.5,91.91 270 top
JP3  142.78,89.91 90 top
JP4  29.35,82.03 90 top
JP5  72.08,103.99 270 top
JP6  120.49,45.79 180 top
JP7  119.27,156.64 0 top
JP9  56.55,60.98 270 top
JP13  78.68,88.56 270 top
LED12V  54.02,44.99 0 top
LED24V  29.08,42.81 0 top
R1  30.05,52.75 270 top
R2  73.56,86.31 270 top
R3  69.15,78.84 90 top
R4  45.26,58.03 0 top
R5  145.45,123.78 0 top
U$1  45.06,71.77 0 top
U$2  133.55,124.18 180 top
ULN.1  102.55,165.02 0 top
ULN.2  95.11,37.99 180 top
ULN.3  148.38,66.14 270 top

### Tracks (layer width: path | path; a pad name or v marks a point on that pad's centre or on a via)
3.3V  (3 unrouted)
  Bottom 1.016: 24.59,99.45 3.3V.1 | 3.3V.3 25.62,96.67 30.01,96.67 30.91,95.77 34.77,95.77 U$1.3.3V | 3.3V.4 3.3V.5
5V  (via drill 1 pad 2.03)  (5 unrouted)
  Top 0.2: 133.63,112.45 134,112.45 B1.5V
  Bottom 1: 18.3,113.45 ENCODER.A.1 | 63.49,75.52 BLUETOOTH.5 | 190.84,98.68 190.84,80.03 ENCODER.D.1 | 33.78,113.91 33.78,111.24
  Bottom 1.016: 5V.5 40.85,113.91 33.78,113.91 ENCODER.A.1 | 5V.5 5V.4 5V.3 5V.2 5V.1 | BLUETOOTH.5 60.13,75.54 60.13,103.36 38.57,103.36 v38.57,103.23 | U$1.5V 38.69,70.5 38.69,93.03 38.45,93.03 | v38.57,103.23 38.57,103.11 | 5V.5 41.08,112.7 | v38.57,103.23 32.06,103.23 | 32.06,103.23 32.06,103.2 | 32.06,103.23 30.05,103.23 30.05,103.44 17.48,103.44 17.48,90.27 ENCODER.B.1
  Bottom 1.27: 190.84,98.68 184.29,98.68 ENCODER.C.1 184.27,123.52 171.98,123.52 | B1.5V 151.8,112.93 R5.2 151.8,123.52 171.98,123.52 | 171.98,123.52 171.98,123.9 5V1.5 5V1.4 5V1.3 5V1.2 5V1.1
12.T1
  Bottom 1: ULN.2.16 105.54,32.64 120.28,32.64
  Bottom 1.27: 12.T1.TRM_1 120.14,26.68 120.14,31.56 12.T1.TRM_2 120.28,31.66 120.28,32.64
12.T2
  Bottom 1: ULN.2.15 101.46,32.36 103.78,30.04 103.88,30.14 112.21,30.14
  Bottom 1.27: 12.T2.TRM_1 12.T2.TRM_2 112.21,30.14
12.T3  (1 unrouted)
  Bottom 1: ULN.2.14 98.92,31.62 12.T3.TRM_2
  Bottom 1.27: 12.T3.TRM_2 104.84,25.09 104.84,21.11 | 104.84,20.61 12.T3.TRM_1
12.T4
  Bottom 1: ULN.2.13 96.38,30.34 98.07,28.65 12.T4.TRM_2
  Bottom 1.27: 12.T4.TRM_2 12.T4.TRM_1
12.T5
  Bottom 1: ULN.2.12 93.84,26.6 12.T5.TRM_2
  Bottom 1.27: 12.T5.TRM_2 12.T5.TRM_1 92.86,22.14
12.T6
  Bottom 1: ULN.2.11 91.3,31.96 86.48,27.15 12.T6.TRM_2
  Bottom 1.27: 12.T6.TRM_2 12.T6.TRM_1
12.T7
  Bottom 1: ULN.2.10 88.76,32.46 88.78,32.44 86.98,30.64 79.48,30.64 79.48,27.39 12.T7.TRM_2
  Bottom 1.27: 12.T7.TRM_1 12.T7.TRM_2
12.T11
  Bottom 1: 12.T11.TRM_1 12.T11.TRM_2 84.25,168.83 ULN.1.16
12.T12
  Bottom 1: ULN.1.15 96.2,170.92 95.28,171.84 91.64,171.84 12.T12.TRM_1 12.T12.TRM_2
12.T13
  Bottom 1: 12.T13.TRM_2 12.T13.TRM_1 96.41,175.58 | ULN.1.14 98.74,173.25 96.41,175.58 | 96.41,175.58 96.18,175.34
12.T14
  Bottom 1: 12.T14.TRM_2 12.T14.TRM_1 101.28,176.8 ULN.1.13
12.T15
  Bottom 1: 12.T15.TRM_2 12.T15.TRM_1 108.58,176.84 103.82,172.08 ULN.1.12
12.T16
  Bottom 1: 12.T16.TRM_2 114.88,181.68 114.88,177 12.T16.TRM_1 115.08,175.74 113.28,173.94 108.77,173.94 106.46,171.63 106.46,169.63 106.36,169.53 ULN.1.11
12.T17
  Bottom 1: 12.T17.TRM_1 121.88,178.86 121.88,173.24 122.08,173.24 122.08,173.58 | 122.08,173.58 12.T17.TRM_2 | 122.08,173.58 120.21,171.71 110.15,171.71 108.9,170.46 ULN.1.10
12V  (via drill 1)  (8 unrouted)
  Top 1.27: v35.48,60.24 34.48,60.24 v34.48,49.24
  Bottom 0.2: 1.14.TRM_1 142.75,159.44 | 142.75,159.44 1.14.TRM_2 | 142.75,159.44 142.55,159.64 141.73,159.64 141.83,159.75 143.48,159.75 1.13.TRM_1 150.47,159.67 | 150.47,153.31 150.4,153.38 1.13.TRM_2 150.47,154.6 1.11.TRM_1 1.11.TRM_2 163.44,159.68 | 163.44,159.68 163.61,159.68 1.8.TRM_2 1.8.TRM_1 | 163.44,159.68 163.63,159.49 1.1.TRM_1 170.01,155.79 170.68,155.12 170.68,155.08 1.1.TRM_2
  Bottom 0.813: 135.46,159.93 143.48,159.93 143.48,159.75 | 1.5.TRM_2 176.93,155.24 | 176.93,155.24 1.5.TRM_1 | 1.12.TRM_1 184.67,154.24 | 184.67,154.24 185.48,154.24 | 184.67,154.24 176.48,154.24 176.48,155.24 | 170.48,153.24 170.48,155.24 176.48,155.24 | 176.48,155.24 176.93,155.24 | 1.3.TRM_1 1.3.TRM_2 | 183.48,145.24 184.73,145.24 1.3.TRM_2 | 177.48,144.21 1.4.TRM_1 1.4.TRM_2 | 177.48,144.21 183.48,144.21 183.48,144.24 | 183.48,144.24 182.48,144.24 | 183.48,144.24 184.73,144.24 1.3.TRM_2 | 1.9.TRM_1 142.53,140.24 144.48,140.24 | 1.7.TRM_1 150.33,144.24 | 150.33,144.24 143.48,144.24 | 158.48,139.21 1.7.TRM_2 150.33,144.24 | 158.48,139.21 158.48,139.24 | 1.2.TRM_2 157.23,139.24 | 157.23,139.24 164.48,139.24 | 157.23,139.24 156.48,139.24 | 156.48,139.24 156.48,143.24 | 156.48,139.24 156.48,138.24 | 156.48,137.24 156.48,138.24 | 156.48,138.24 158.48,138.24 158.48,139.21 | 1.TRM_2 | 1.TRM_2 1.TRM_1 170.59,144.24 177.48,144.24 177.48,144.21 | 1.6.TRM_1 1.6.TRM_2 1.TRM_2
  Bottom 1.016: 1.9.TRM_2 142.41,139.44 135.46,139.44 | ULN.1.9 117.41,162.86 132.53,162.86 135.46,159.93 135.46,139.44 | 135.46,139.44 135.46,130.08 129.41,130.08 129.41,105.31 B1.VIN
  Bottom 1.27: 150.47,159.67 150.47,153.31 | 1.13.TRM_1 150.48,159.75 | v34.48,49.24 41.98,49.24 F3.2 41.98,44.99 LED12V.A 52.75,34.04 56.58,34.04 | U$1.RAW 34.9,60.24 v35.48,60.24 | ULN.2.9 86.22,35.24 76.48,35.24 76.48,34.24
23
  Bottom 1: B1.23 ULN.2.7
24.T1
  Bottom 1.27: ULN.3.16 154.59,77.43 154.59,85.68 156.11,87.2 24.T1.TRM_2 24.T1.TRM_1
24.T2
  Bottom 1.27: ULN.3.15 154.1,72.49 157.23,75.62 157.23,77.67 159.7,80.14 24.T2.TRM_1 24.T2.TRM_2
24.T3
  Bottom 1.27: 24.T3.TRM_1 24.T3.TRM_2 159.15,72.53 157.6,72.53 155.02,69.95 ULN.3.14
24.T4
  Bottom 1.27: ULN.3.13 157,67.41 157.72,68.14 24.T4.TRM_1 24.T4.TRM_2
24.T5  (1 unrouted)
  Bottom 1.27: 24.T5.TRM_1 161.91,63.13 | 24.T5.TRM_2 165.95,61.66 | 166.59,61.66 163.38,61.66 24.T5.TRM_1 | ULN.3.12 152.22,64.84 159.59,64.42 24.T5.TRM_1 | 162.09,62.5 24.T5.TRM_1
24.T6
  Bottom 1.27: ULN.3.11 152.31,62.21 156.66,62.21 160.69,58.18 24.T6.TRM_2 24.T6.TRM_1
24.T7
  Bottom 1.27: ULN.3.10 153.68,59.79 24.T7.TRM_2 24.T7.TRM_1
24V  (via drill 2.5 pad 2.5)  (2 unrouted)
  Top 1: v2.78,28.64 4.48,26.94 32.88,26.94
  Bottom 1: ULN.3.9 152.19,49.43
  Bottom 1.27: LED24V.A 26.99,42.16 26.84,39.47 D1.C | F5.2 143.02,194.74 189.88,194.74 196.58,188.04 196.58,44.04 191.58,44.04 | 152.19,49.43 152.19,43.94 168.38,43.94
  Bottom 2.54: 142.82,174.08 F7.2 143.02,173.89 F5.2 143.02,194.58 51.88,194.58 51.88,186.68 F8.2 | D1.C 32.58,33.73 32.58,28.84 | F8.2 51.98,186.62 51.98,194.74 9.48,194.74 2.88,188.14 2.88,28.74 v2.78,28.64 | F8.2 51.96,175.06 F1.2 47.21,170.31 47.21,163.96 2.1.TRM_1 | 2.3.TRM_1 2.3.TRM_2 25.67,152.38 2.6.TRM_1 | 2.6.TRM_1 34.98,152.38 | 34.98,152.38 2.2.TRM_2 2.2.TRM_1 45.28,163.96 | 45.28,163.96 | 45.28,163.24 45.28,163.96 | 45.28,163.96 2.1.TRM_1 | 2.1.TRM_1 2.1.TRM_2 | 2.1.TRM_2 42.91,158.14 | 2.1.TRM_2 43.38,158.88 43.38,158.14 42.91,158.14 | 2.1.TRM_1 53.46,163.96 | 53.46,163.96 2.TRM_1 | 53.46,163.96 2.TRM_2 53.46,158.14 53.38,158.14 | 2.4.TRM_1 42.91,152.51 42.91,158.14 | 34.98,152.38 2.5.TRM_1 2.5.TRM_2 | 2.4.TRM_2 2.4.TRM_1 | 48.48,153.14 48.47,153.14 2.4.TRM_1 | 2.6.TRM_1 31.23,148.14 31.08,148.14 31.08,147.3 2.6.TRM_2
25
  Bottom 1: B1.25 ULN.2.6
26
  Bottom 1: ULN.1.1 93.66,57.24 B1.26
27
  Bottom 1: B1.27 ULN.2.5
28
  Bottom 1: ULN.1.2 96.2,57.24 B1.28
29
  Bottom 1: B1.29 ULN.2.4
30
  Bottom 1: ULN.1.3 98.74,57.24 B1.30
31
  Bottom 1: B1.31 ULN.2.3
32
  Bottom 1: ULN.1.4 101.28,57.24 B1.32
33
  Bottom 1: B1.33 ULN.2.2
34
  Bottom 1: ULN.1.5 103.82,57.24 B1.34
35
  Bottom 1: B1.35 ULN.2.1
36
  Bottom 1: ULN.1.6 106.36,57.24 B1.36
38
  Bottom 1: ULN.1.7 108.9,57.24 B1.38
40
  Bottom 1: JP7.1 111.65,57.05 B1.40
A9
  Bottom 1.016: B1.A9 134.49,75.03 ULN.3.1
A10
  Bottom 1.016: B1.A10 134.49,72.49 ULN.3.2
A11
  Bottom 1.016: B1.A11 134.49,69.95 ULN.3.3
A12
  Bottom 1.016: B1.A12 144.57,67.21 ULN.3.4
A13
  Bottom 1.016: B1.A13 141.81,64.67 141.81,64.87 ULN.3.5
A14
  Bottom 1.016: B1.A14 134.49,62.33 ULN.3.6
A15
  Bottom 1.016: B1.A15 134.49,59.79 ULN.3.7
DIR.A  (1 unrouted)
  Bottom 1: DRIVER.1.1 17.86,134.58 74.03,134.58 74.03,138.24 89.07,138.24 89.07,57.35
DIR.B  (1 unrouted)
  Bottom 1: DRIVER.1.3 17.36,129.2 13.07,129.2 13.07,137.38 71.67,137.38 71.67,141.24 91.48,141.24 91.48,57.24
DIR.C
  Bottom 1: DRIVER.2.1 148.38,95.84 148.38,41.74 111.28,41.74 108.98,44.04 108.98,54.4 B1.39
DIR.D
  Bottom 1: DRIVER.2.3 173.78,100.92 173.78,31.14 158.08,31.14 158.08,39.34 109.58,39.34 106.55,42.37 B1.37
GND  (via drill 1, 1 pad 1.3)  (7 unrouted)
  Top 1: v140.18,44.64 140.38,44.44 v140.38,36.04
  Bottom 1: BLUETOOTH.4 63.49,77.86 66.61,77.86 66.61,73.76 R3.1 69.15,71.61 69.08,71.54 | ENCODER.B.2 18.08,87.2 24.64,87.2 24.64,61.42 28.36,57.69 | ULN.2.8 86.22,38.94 86.08,38.94 86.08,38.54 86.68,37.94 107.18,37.94 109.08,36.04 v140.38,36.04 140.48,36.04 140.58,36.14 | 192.38,77.49 192.38,77.44 192.89,77.44 192.89,77.59 | B1.GND@3 140.05,54.51 140.18,54.64 v140.18,44.64 140.18,44.44 | U$1.GND1 52.84,70.5 53.18,70.84 59.28,64.74 v69.58,64.74 69.88,64.74 | 162.54,106.25 DRIVER.2.5
  Bottom 1.016: U$1.GND 40.21,65.42 40.21,57.69 39.64,57.69 28.36,57.69 | B1.GND@2 144.57,57.05 ULN.3.8 | B1.GND@4 85.01,124.36 79.99,129.38 GND1.1 GND1.2 67.51,128.36 | GND1.3 GND1.4 GND1.5 | DRIVER.1.5 17.36,123.92 | ENCODER.B.2 17.09,87.16 | GND.5 GND.4 GND.3 | GND.3 155.06,129.46 | 155.06,128.58 155.06,129.46 | GND.3 154.71,129.85 155.06,129.85 155.06,129.46 | 155.06,129.46 GND.2 GND.1 | B1.GND | ENCODER.A.2 18.3,111.24
  Bottom 1.27: 23.28,19.03 24V4.2 23.28,18.18 | 188.12,170.31 24V1.2 187.77,170.31 | 192.79,165.28 192.79,131.98 | GND.1 159.79,131.17 193.49,131.17 193.49,78.19 192.89,77.59 | DRIVER.2.5 178.48,106 178.48,96.16 ENCODER.C.2 | ENCODER.C.2 184.39,96.04 | 30.03,57.95 30.03,57.81 R1.1 28.5,57.83 28.36,57.69 | R4.1 39.85,57.69 39.64,57.69 | 12.74,90.08 13.13,90.08 | ULN.1.8 111.44,164.83 66.36,164.83 | 24V3.2 17.68,189.98 | B1.GND 158.4,110.39 162.54,106.25 | U$2.1 145.98,129.46 GND.5 | GND1.3 GND1.2 | 192.38,77.49 ENCODER.D.2 183.38,77.49 183.38,85.54 188.08,85.54 188.08,96.16 ENCODER.C.2 | ENCODER.A.2 12.74,111.37 12.74,111.94 | ENCODER.B.2 13.13,87.16 13.13,86.94 | DRIVER.1.5 12.74,124.02 12.74,123.62 | 186.57,166.24 186.97,165.84 192.88,165.84
  Bottom 2.54: 12.74,90.08 12.74,111.94 12.74,123.62 8.81,123.62 8.81,140.65 9.21,140.65 | 12V1.2 47.59,8.46 23.28,8.46 | 24V3.2 12.05,189.02 9.39,186.36 9.39,175.74 | 24V5.2 9.21,175.43 9.21,140.65 | 24V4.2 23.28,8.46 | 23.28,8.46 12.53,8.46 12.53,86.34 13.13,86.94 13.13,90.08 | 9.21,140.65 66.36,140.65 66.36,164.83 66.36,189.74 137.68,189.74 137.68,166.24 157.8,166.24 | 24V2.2 185.18,181.77 176.28,181.77 175.5,180.99 157.8,180.99 157.8,166.24 | 24V1.2 186.57,166.24 157.8,166.24
INT1.A
  Bottom 1: ENCODER.A.3 68.38,108.83 68.38,94.81 85.38,94.81 85.38,95.15 B1.3
INT1.B
  Bottom 1: ENCODER.B.3 21.21,84.62 | 42.71,59.87 42.71,75.58 U$1.D3
  Bottom 1.016: 21.21,84.62 21.21,60.31 26.86,54.66 42.71,54.66 42.71,59.87
INT1.C
  Bottom 1: 128.68,13.72 128.68,22.94 181.01,22.94
  Bottom 1.016: B1.20 80.89,67.21 80.89,56.97 67.96,56.97 67.96,13.72 128.68,13.72 | 181.01,22.94 181.01,91.35 184.27,91.35 ENCODER.C.4
INT1.D  (1 unrouted)
  Bottom 1: 186.98,74.94 190.58,74.94 190.58,47.94 187.08,47.94 187.08,39.04 187.68,38.44 | 135.38,8.37 135.38,17.54 187.88,17.54 187.68,17.74 187.68,38.44 | 187.68,38.44 187.78,38.34
  Bottom 1.016: B1.18 83.39,72.29 | 83.39,72.29 76.07,72.29 76.07,62.48 61.47,62.48 61.47,8.37 135.38,8.37 | 83.39,72.29 83.39,72.3
INT2.A
  Bottom 1: B1.2 85.93,92.31 65.68,92.31 65.68,102.14 65.68,105.78 60.78,105.78 | 60.78,105.78 60.78,105.72 | 60.78,105.78 18.81,105.78 ENCODER.A.4
INT2.B
  Bottom 1: U$1.D2 45.41,73.04 45.41,52.39
  Bottom 1.016: 45.41,52.39 25.33,52.39 18.28,59.44 18.28,81.31 18.05,81.54 ENCODER.B.4
INT2.C
  Bottom 1: 178.67,25.44 125.78,25.44 125.78,16.41
  Bottom 1.016: B1.21 85.93,64.67 85.93,61.5 83.03,61.5 83.03,53.93 70.93,53.93 70.93,16.41 125.78,16.41 | 178.67,25.44 178.67,93.62 ENCODER.C.3
INT2.D
  Bottom 1: ENCODER.D.4 184.55,72.41 | 131.88,10.99 131.88,20.14 184.55,20.14
  Bottom 1.016: B1.19 78.31,69.76 78.31,59.77 64.85,59.77 64.85,10.99 131.88,10.99 | 184.55,20.14 184.55,72.41
N$9
  Bottom 1: JP5.1 80.48,110.34 80.48,111.59 86.48,111.59 86.48,111.66 B1.9
N$10
  Bottom 1: B1.8 82.48,109.12 82.48,107.8 JP5.2
N$11
  Bottom 1: JP5.3 86.23,105.26 B1.7
N$12
  Bottom 1: JP5.4 86.23,102.72 B1.6
N$13  (1 unrouted)
  Bottom 1: B1.5 72.14,100.23
N$14
  Bottom 1: JP5.6 86.23,97.64 B1.4
N$15
  Bottom 2.54: 24V1.1 185.87,174.61 166.94,174.61 F7.1
N$16
  Bottom 1.27: 24V4.1 18.59,18.54
  Bottom 2.54: F6.1 18.59,18.54
N$17
  Bottom 1.016: JP13.1 86.23,89.83 B1.1
N$18
  Bottom 1.016: B1.0 78.68,87.53 JP13.2
N$21
  Bottom 2.54: 24V2.1 165.81,188.47 F5.1
N$22
  Bottom 1.27: 16.8,184.1 24V3.1
  Bottom 2.54: F8.1 26.95,184.1 16.8,184.1
N$23
  Bottom 1.27: LED24V.K 30.45,42.71 30.45,48.07 R1.2
N$24
  Bottom 1.27: 55.06,44.76 LED12V.K | 55.06,44.42 55.06,44.76 | R4.2 55.06,53.31 55.06,44.76
N$25
  Bottom 2.54: F6.2 18.59,39.05 27.91,29.73 27.91,23.15 D1.A
N$26
  Top 1.016: 38.82,103.11 38.57,103.11
N$27  (via drill 1 pad 2.03)
  Top 1.27: v38.82,93.15 38.48,93.15 38.48,102.24
N$28  (via drill 1 pad 2.03)
  Top 1: v8.78,120.24 18.08,120.24 v18.08,120.34
  Bottom 1: 140.28,2.34 140.28,11.94 170.88,11.94 170.88,14.94 171.08,14.94
  Bottom 1.016: v8.78,120.24 6.28,120.24 6.28,2.34 140.28,2.34
N$29  (via drill 1 pad 2.03)
  Top 1: 17.48,117.14 17.48,117.24 v8.98,117.24
  Bottom 1: 8.68,5.04 51.41,5.04 51.6,5.24 137.78,5.24 137.78,14.14 165.58,14.14
  Bottom 1.016: v8.98,117.24 8.68,116.94 8.68,5.04
N$30  (via drill 1)
  Top 1: v56.48,34.14 76.08,34.14 76.08,34.44 76.28,34.44
N$31  (via drill 1)
  other vias: 76.28,34.34
N$32  (via drill 1)
  other vias: 33.58,111.44
N$33  (via drill 1)
  Top 1: v33.18,103.14 33.18,111.14 33.78,111.74
N$34  (via drill 2.5 pad 2.5)
  other vias: 32.48,28.24
N$35  (via drill 1 pad 1.3)
  Top 1.27: v168.18,44.14 191.78,44.14
N$36  (via drill 1 pad 1.3)
  other vias: 191.78,44.34
N$37
  Bottom 1: JP7.2 114.19,57.05 B1.42
N$38
  Bottom 1: JP7.3 116.71,156.64 B1.44
N$39
  Bottom 1: JP7.4 119.37,156.54 119.37,61.94 119.25,61.94 B1.46
N$40
  Bottom 1: JP7.5 121.81,57.05 B1.48
N$41
  Bottom 1: JP7.6 124.35,57.05 B1.50
N$42  (1 unrouted)
  Bottom 1: JP7.7 126.89,55.74
N$44  (via drill 1)
  Top 1: v165.58,14.04 165.58,28.04 165.18,28.04
N$46  (via drill 1 pad 1.3)
  Top 1: v69.08,71.64 69.58,71.14 69.58,64.84
N$50
  Bottom 1.016: B1.A0 142.78,100.23 JP3.9
N$51
  Bottom 1.016: B1.A1 142.78,97.69 JP3.8
N$52
  Bottom 1.016: B1.A2 142.78,95.15 JP3.7
N$53
  Bottom 1.016: B1.A3 142.78,92.61 JP3.6
N$54
  Bottom 1.016: B1.A4 142.78,90.07 JP3.5
N$55
  Bottom 1.016: B1.A5 142.78,87.53 JP3.4
N$56
  Bottom 1.016: B1.A6 142.78,84.99 JP3.3
N$57
  Bottom 1.016: B1.A7 142.78,82.45 JP3.2
N$58
  Bottom 1.016: B1.A8 134.49,79.92 142.78,79.92 JP3.1
N$75
  Bottom 1: B1.41 111.63,47.03 JP6.7
N$76
  Bottom 1: B1.45 116.71,50.71 117.95,49.47 JP6.5
N$77
  Bottom 1: B1.43 114.17,49.13 115.41,47.89 JP6.6
N$78
  Bottom 1: B1.47 119.38,54.38 119.38,51.14 120.49,50.03 JP6.4
N$79
  Bottom 1: B1.49 121.79,51.73 123.03,50.49 JP6.3
N$80
  Bottom 1: B1.51 124.33,52.04 125.57,50.8 JP6.2
N$81
  Bottom 1: JP6.1 128.18,45.86 128.18,51.34 126.87,52.65 B1.53
N$107
  Bottom 1: U$1.D13 44.11,98.44 44.11,100.97 56.33,100.97 JP1.1
N$110
  Bottom 1: JP4.8 34.9,90.92 U$1.A0
N$111
  Bottom 1: JP4.7 34.9,88.38 U$1.A1
N$112
  Bottom 1: JP4.6 34.9,85.84 U$1.A2
N$113
  Bottom 1: U$1.A3 29.35,83.2 JP4.5
N$114
  Bottom 1: JP4.4 34.9,80.76 U$1.A4
N$115
  Bottom 1: U$1.A5 29.35,78.12 JP4.3
N$116
  Bottom 1: JP4.2 34.9,75.68 U$1.A6
N$117
  Bottom 1: JP4.1 34.9,73.14 U$1.A7
N$122
  Bottom 1: U$1.D12 50.14,98.26 JP1.2
N$123
  Bottom 1: U$1.D11 56.5,95.9 JP1.3
N$124
  Bottom 1: U$1.D10 56.5,93.36 JP1.4
N$125
  Bottom 1: U$1.D9 56.5,90.82 JP1.5
N$126
  Bottom 1: U$1.D8 56.5,88.28 JP1.6
N$127
  Bottom 1: JP1.7 56.5,85.74 U$1.D7
N$128
  Bottom 1: U$1.D6 50.14,83.02 JP1.8
N$135
  Bottom 1.016: JP9.1 53.38,65.42 U$1.RX1
N$136
  Bottom 1.016: U$1.TX0 50.34,62.68 51.84,62.68 54.85,59.67 56.51,59.67 JP9.2
N$138
  Bottom 2.54: F1.1 26.12,171.73 15.86,171.73 24V5.1
N$152
  Bottom 1.27: 12V1.1 41.98,17.83
  Bottom 2.54: F3.1 41.98,17.83
PWM.A
  Bottom 1: DRIVER.1.2 17.48,131.66 29.58,131.66 29.58,125.58 80.91,125.58 84.67,121.82 B1.13
PWM.B  (1 unrouted)
  Bottom 1: 26.66,122.89 80.72,122.89 84.32,119.28 B1.12 | 17.56,126.66 26.72,126.66 26.72,123.45
  Bottom 1.27: DRIVER.1.4 17.56,126.66
PWM.C  (via drill 1, 1 pad 2.03)  (1 unrouted)
  Top 1: 171.18,33.34 170.88,33.34 v170.88,33.74 v170.88,15.04 170.88,14.84 171.08,14.84
  Bottom 1.016: B1.11 59.32,116.74 | 59.32,116.74 59.32,116.58 | 59.32,116.74 59.32,120.33 18.2,120.33 | DRIVER.2.2 171.18,98.38 171.18,34.04 v170.88,33.74
PWM.D  (via drill 1 pad 2.03)  (1 unrouted)
  Bottom 1.016: 86.23,114.11 56.23,114.11 56.23,117.24 v17.48,117.24 | DRIVER.2.4 162.54,103.24 176.18,103.24 176.18,28.24 164.78,28.24 v164.68,28.14
  Bottom 1.27: B1.10 86.23,114.11
RESET.MEGA
  Bottom 1: U$2.2 139.1,119.1 | 139.1,119.1 138.28,119.1 138.28,118.01 B1.RESET | R5.1 139.1,119.1
RX.BLUE
  Bottom 1: R2.1 73.56,88.05 69.15,88.05 R3.2 69.15,83.24 63.49,83.24 BLUETOOTH.2
RX.NANO
  Bottom 1: U$1.D5 57.86,80.66 57.86,73.26 61.88,69.24 71.52,69.24 71.52,77.37 B1.16
TX.BLUE
  Bottom 1: BLUETOOTH.3 63.8,80.31 81.53,80.31 81.93,79.91 B1.15
TX.MEGA
  Bottom 1: R2.2 86.18,82.5 B1.14
TX.NANO
  Bottom 1: U$1.D4 50.11,78.12 50.11,77.99 55.44,77.99 55.44,72.78 61.34,66.88 73.82,66.88 73.82,74.64 86.23,74.64 B1.17
(copper drawn outside any net)
  shapes: Bottom area x24

### Text on the board
Bottom: M.I.A2019